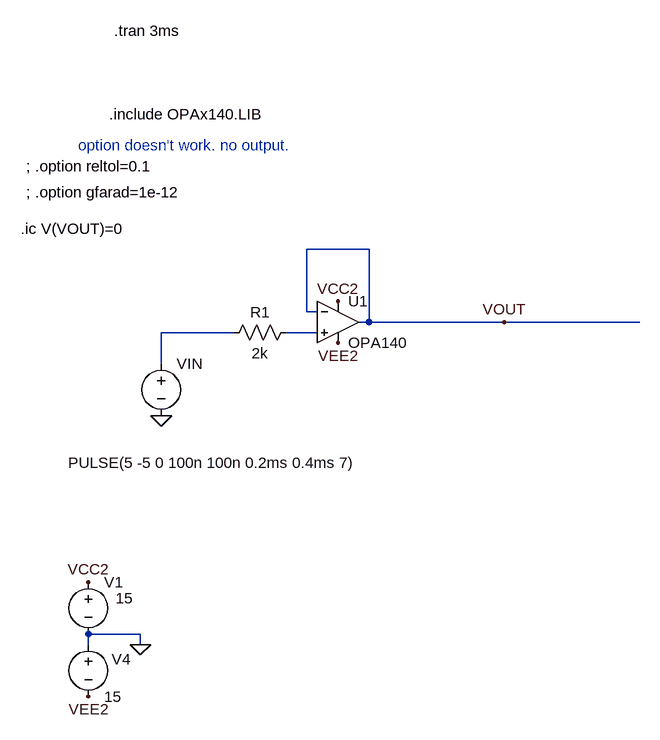
[diagram p0: schematic Draft45.asc]
Draft45.asc, the LTspice schematic file:
Version 4
SHEET 1 2336 896
WIRE 288 48 192 48
WIRE 192 144 192 48
WIRE 208 144 192 144
WIRE 288 160 288 48
WIRE 288 160 272 160
WIRE 496 160 288 160
WIRE 704 160 496 160
WIRE 80 176 -32 176
WIRE 208 176 160 176
WIRE -32 224 -32 176
WIRE -64 640 -144 640
WIRE -144 656 -144 640
WIRE -64 656 -64 640
FLAG -32 304 0
FLAG -64 656 0
FLAG -144 560 VCC2
FLAG -144 736 VEE2
FLAG 240 128 VCC2
FLAG 240 192 VEE2
FLAG 496 160 VOUT
SYMBOL voltage -32 208 R0
WINDOW 123 0 0 Left 0
WINDOW 39 0 0 Left 0
WINDOW 3 -143 168 Left 2
SYMATTR Value PULSE(5 -5 0 100n 100n 0.2ms 0.4ms 7)
SYMATTR InstName VIN
SYMBOL voltage -144 544 R0
WINDOW 123 0 0 Left 0
WINDOW 39 0 0 Left 0
WINDOW 3 42 41 Left 2
SYMATTR Value 15
SYMATTR InstName V1
SYMBOL voltage -144 640 R0
WINDOW 123 0 0 Left 0
WINDOW 39 0 0 Left 0
WINDOW 0 36 39 Left 2
SYMATTR InstName V4
SYMATTR Value 15
SYMBOL OPA140 240 96 R0
SYMATTR InstName U1
SYMBOL res 176 160 R90
WINDOW 0 0 56 VBottom 2
WINDOW 3 32 56 VTop 2
SYMATTR InstName R1
SYMATTR Value 2k
TEXT -104 -288 Left 2 !.tran 3ms
TEXT -112 -160 Left 2 !.include OPAx140.LIB
TEXT -240 -80 Left 2 !; .option reltol=0.1
TEXT -160 -112 Left 2 ;option doesn't work. no output.
TEXT -240 -40 Left 2 !; .option gfarad=1e-12
TEXT -248 16 Left 2 !.ic V(VOUT)=0

The netlist it stands for:
* Draft45.asc
VIN N001 0 PULSE(5 -5 0 100n 100n 0.2ms 0.4ms 7)
V1 VCC2 0 15
V4 0 VEE2 15
* U1: OPA140 (symbol OPA140 not available, pins judged from their places): In+=N002 In-=VOUT V+=VCC2 V-=VEE2 OUT=VOUT
R1 N002 N001 2k
.tran 3ms
.include OPAx140.LIB
; .option reltol=0.1
* option doesn't work. no output.
; .option gfarad=1e-12
.ic V(VOUT)=0
.backanno
.end